# EAGLE design workingflasher (EAGLE 7.1.0)
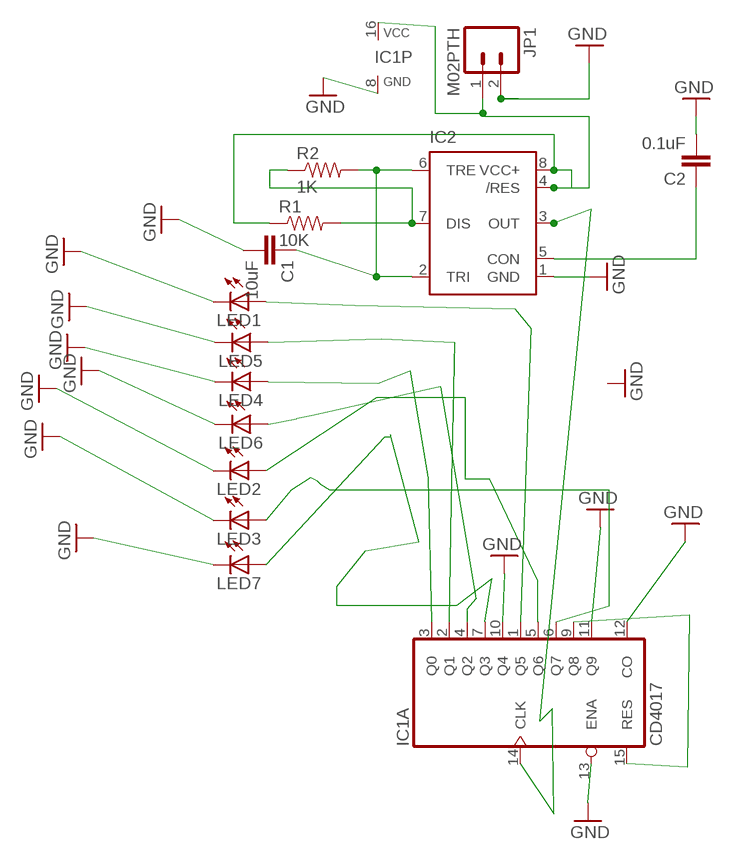
[diagram p0: schematic, sheet 1]

## Parts
C1  10uF  10UF50V20%(1210)  [1210]
C2  0.1uF  0.1UF-25V(+80/-20%)(0603)  [0603-CAP]
IC1  CD4017  [DIL16]
IC2  NE555D  [SO08]
JP1  M02PTH  [1X02]
LED1  LED1206  [LED-1206]
LED2  LED1206  [LED-1206]
LED3  LED1206  [LED-1206]
LED4  LED1206  [LED-1206]
LED5  LED1206  [LED-1206]
LED6  LED1206  [LED-1206]
LED7  LED1206  [LED-1206]
R1  10K  0OHM1/10W5%(0603)  [0603]
R2  1K  0OHM1/10W5%(0603)  [0603]

## Nets
GND: C1.2 C2.2 IC1.8(P:GND) IC1.10(A:Q4) IC1.11(A:Q9) IC1.12(A:CO) IC1.13(A:ENA) IC2.1(GND) JP1.2 LED1.C LED2.C LED3.C LED4.C LED5.C LED6.C LED7.C
N$1: IC1.1(A:Q5) LED1.A
N$2: IC1.5(A:Q6) LED2.A
N$3: IC1.9(A:Q8) IC1.15(A:RES)
N$4: IC1.7(A:Q3) LED7.A
N$5: IC1.3(A:Q0) LED4.A
N$6: IC1.4(A:Q2) LED6.A
N$7: IC1.2(A:Q1) LED5.A
N$8: C2.1 IC2.5(CON)
N$10: C1.1 IC2.2(TRI) IC2.6(TRE) R2.2
N$11: IC1.16(P:VCC) IC2.4(/RES) IC2.8(VCC+) JP1.1 R1.1
N$12: IC2.7(DIS) R1.2 R2.1
N$14: IC1.14(A:CLK) IC2.3(OUT)
N$15: IC1.6(A:Q7) LED3.A

## Library data of the parts
C1 = SparkFun-Capacitors:10UF50V20%(1210): CAP-09824; PROD_ID: CAP-09824
C2 = SparkFun-Capacitors:0.1UF-25V(+80/-20%)(0603): CAP-00810 Ceramic Standard decoupling cap; PROD_ID: CAP-00810
IC1 = SparkFun-DigitalIC:CD4017
IC2 = SparkFun-AnalogIC:NE555: General purpose bipolar Timer
JP1 = SparkFun-Connectors:M02: Standard 2-pin 0.1" header. Use with - straight break away headers ( PRT-00116) - right angle break away headers (PRT-00553) - swiss pins (PRT-00743) - machine pins (PRT-00117) - female headers (PRT-00115) Molex polarized connector foot print use with: PRT-08233 with associated crimp pins and housings. 2.54_SCREWTERM for use with PRT-10571. 3.5mm Screw Terminal footprints for PRT-08084 5mm Screw Terminal footprints for use with PRT-08433
LED1-LED7 = SparkFun-LED:LED: LEDs Standard schematic elements and footprints for 5mm, 3mm, 1206, and 0603 sized LEDs. 5mm - Spark Fun Electronics SKU : COM-00529 (and others)
R1 R2 = SparkFun-Resistors:0OHM1/10W5%(0603): RES-08609; PROD_ID: RES-08609; VALUE: 0

## Board
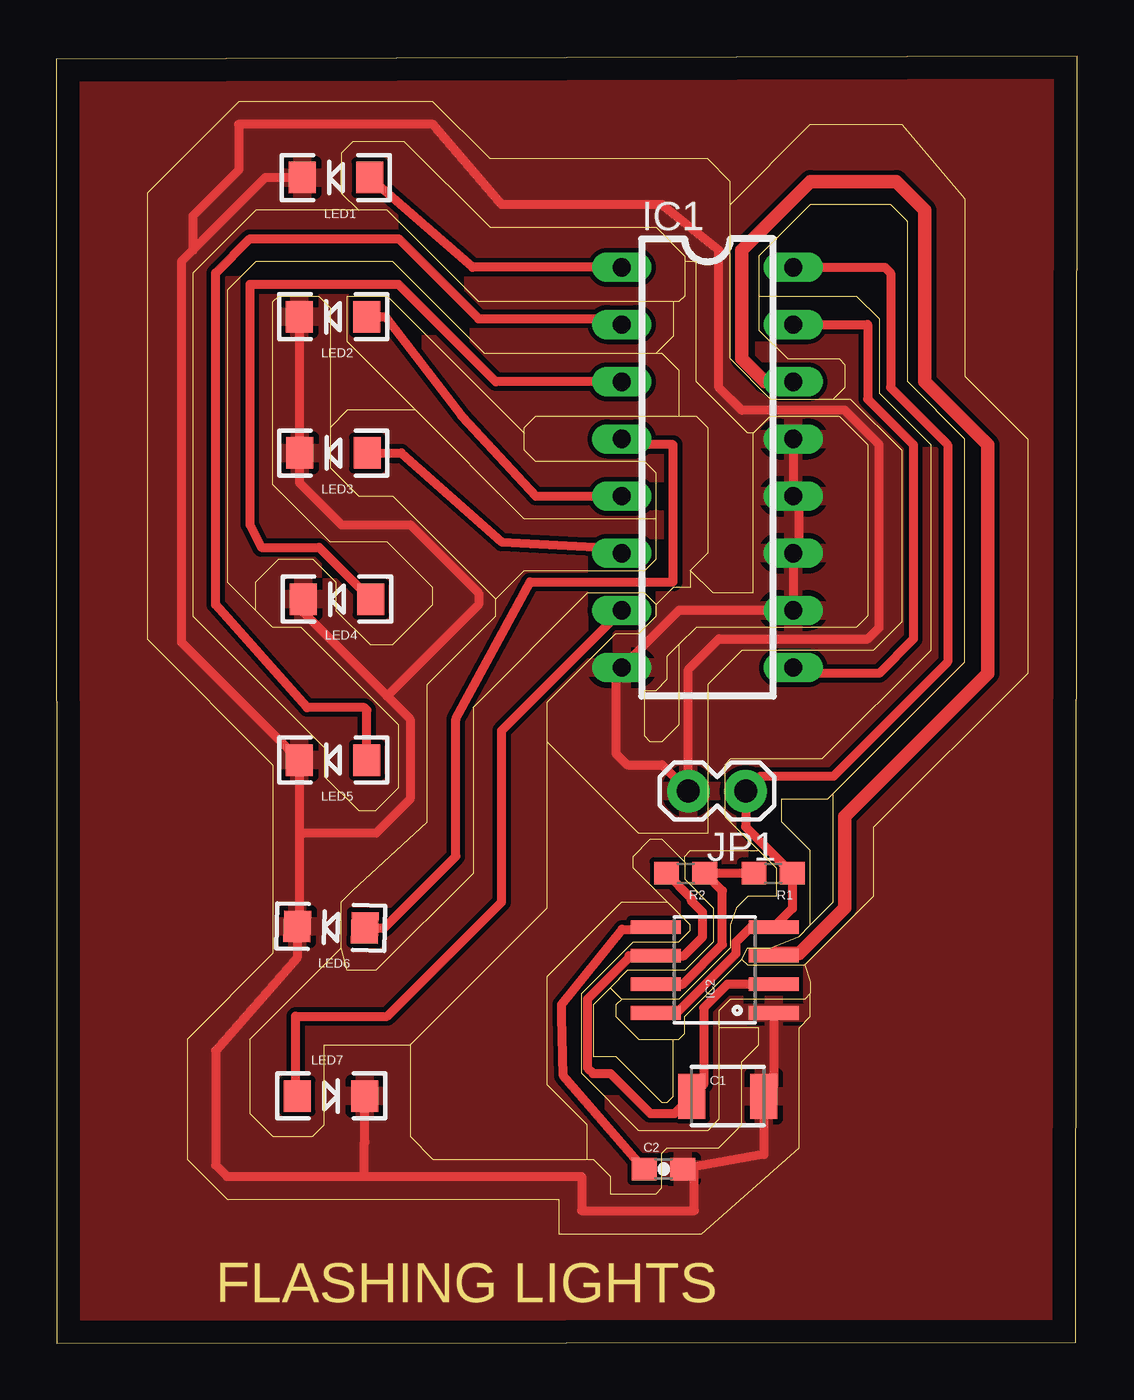
[diagram p1: board, top side]

Size 45.34 x 57.17 mm. Coordinates in mm from the lower left corner, seen from the top.
Outline: 0.01,0 45.27,0.04 45.34,57.17 0,57.05 0.01,0
Copper layers (1*16): Top 0.035mm / dielectric 1.5mm / Bottom 0.035mm
Design rules "default": minimum track width 10mil, minimum drill 24mil, track to track 8mil, track to pad 8mil, pad to pad 8mil, via to via 8mil, smd to smd 8mil, copper to edge 40mil, drill to drill 8mil, minimum pad ring 10mil, minimum via ring 8mil, stop-mask expansion 4mil, vias tented up to drill 0mil, thermal gap 10mil
Milling: 287 lines

### Footprints (pad centres in the part's own frame; a part is rotated, then mirrored left to right if it is on the bottom)
1210 = smd 1.2 x 2: 1 -1.6,0; 2 1.6,0
0603-CAP = smd 1.1 x 1: 1 -0.85,0; 2 0.85,0
DIL16 = drill 0.813 long: 1 -8.89,-3.81; 2 -6.35,-3.81; 3 -3.81,-3.81; 4 -1.27,-3.81; 5 1.27,-3.81; 6 3.81,-3.81; 7 6.35,-3.81; 8 8.89,-3.81; 9 8.89,3.81; 10 6.35,3.81; 11 3.81,3.81; 12 1.27,3.81; 13 -1.27,3.81; 14 -3.81,3.81; 15 -6.35,3.81; 16 -8.89,3.81
SO08 = smd 0.61 x 2.21: 1 -1.905,-2.616; 2 -0.635,-2.616; 3 0.635,-2.616; 4 1.905,-2.616; 5 1.905,2.616; 6 0.635,2.616; 7 -0.635,2.616; 8 -1.905,2.616
1X02 = drill 1.016 pad 1.88: 1 0,0; 2 2.54,0
LED-1206 = smd 1.2 x 1.4: A -1.5,0; C 1.5,0
0603 = smd 1.1 x 1: 1 -0.85,0; 2 0.85,0

### Placement (x,y rotation side)
C1  29.83,10.97 0 top
C2  26.97,7.73 0 top
IC1  28.92,38.91 270 top
IC2  29.24,16.58 90 top
JP1  30.61,24.53 180 top
LED1  12.42,51.78 180 top
LED2  12.3,45.6 180 top
LED3  12.3,39.55 180 top
LED4  12.47,33.06 180 top
LED5  12.29,25.9 180 top
LED6  12.2,18.49 178.7 top
LED7  12.21,10.98 0 top
R1  31.83,20.88 180 top
R2  27.95,20.88 180 top

### Tracks (layer width: path | path; a pad name or v marks a point on that pad's centre or on a via)
GND
  Top 0.406: 28.34,7.83 31.43,8.38 C1.2 31.86,11.4 IC2.1 | 28.34,7.83 C2.2 | 13.68,7.41 13.68,8.93 13.71,8.93 LED7.C | 13.68,7.41 23.33,7.41 23.33,5.89 28.34,5.89 28.34,7.83 | IC1.13 IC1.12 32.98,37.38 32.98,35.35 IC1.11 IC1.10 27.65,32.56 IC1.8 24.86,29.76 24.86,26.21 25.36,25.7 26.9,25.7 JP1.2 28.07,29.93 29.43,31.29 36.03,31.29 36.54,31.79 36.54,39.92 35.02,41.45 30.44,41.45 29.43,42.46 29.43,48.56 26.89,50.59 19.78,50.59 16.73,54.15 8.09,54.15 8.09,52.11 6.06,50.08 6.06,48.56 | 13.68,7.41 7.58,7.41 7.08,7.92 7.08,13 10.7,17.13 LED6.C 10.79,18.61 10.79,22.65 | LED1.C 9.29,51.78 6.06,48.56 | 6.06,48.56 5.55,48.05 5.55,31.14 LED5.C 10.79,22.65 | LED4.C 10.97,32.48 14.7,28.75 | 14.7,28.75 15.71,27.73 15.71,24.17 14.19,22.65 10.79,22.65 | LED3.C 10.8,39.56 LED2.C 10.8,38.23 12.66,36.37 15.71,36.37 18.76,33.32 18.76,32.81 14.7,28.75
  pour Top: -0.81,57.56 46.2,58.22 46.13,-1.17 -0.63,-0.83
N$1
  Top 0.406: IC1.1 18.49,47.8 LED1.A
N$2
  Top 0.406: LED2.A 14.61,45.6 18,41.19 21.3,37.64 IC1.5
N$3
  Top 0.406: IC1.15 36.03,45.26 36.03,41.95 38.06,39.92 38.06,31.29 36.54,29.76 32.98,29.76 IC1.9
N$4
  Top 0.406: LED7.A 10.63,10.98 10.63,14.52 14.7,14.52 19.78,19.6 19.78,27.22 IC1.7
N$5
  Top 0.406: IC1.3 19.52,42.72 15.2,47.03 8.6,47.03 8.6,36.37 9.11,35.35 11.68,35.35 LED4.A
N$6
  Top 0.406: LED6.A 14.56,18.45 17.74,21.63 17.74,27.73 21.05,33.83 27.4,33.83 27.4,39.92 25.36,39.92 IC1.4
N$7
  Top 0.406: LED5.A 13.79,28.13 13.68,28.24 11.14,28.24 7.08,32.81 7.08,47.54 8.6,49.07 15.2,49.07 18.76,45.51 24.86,45.51 IC1.2
N$8
  Top 0.406: C2.1 22.52,11.88 22.44,14.53 22.44,15.05 25.13,18.39 26.53,18.39 IC2.5
N$10
  Top 0.406: IC2.2 29.81,15.95 28.75,14.89 28.75,11.49 C1.1 | 28.18,11.01 C1.1 | R2.2 28.21,19.77 28.21,19.64 28.71,19.14 28.71,18.05 27.87,17.22 IC2.6 25.44,17.22 25.44,17.14 23.59,15.28 23.59,12.24 23.84,11.98 24.6,11.98 26.38,10.2 27.46,10.2 C1.1
N$11
  Top 0.406: IC2.4 31.38,18.49 | IC2.8 26.65,14.65 27.55,14.65 27.55,14.67 30.19,17.32 30.19,17.82 30.95,18.59 31.76,18.59 IC2.4 | IC1.16 36.79,47.8 37.05,47.54 37.05,42.46 39.59,39.92 39.59,30.27 34.51,25.19 31.27,25.19 JP1.1 30.61,22.95 R1.1 32.68,19.31 IC2.4
N$12
  Top 0.406: R1.2 R2.1 29.58,20.1 29.58,17.71 27.81,15.95 IC2.7
N$14
  Top 0.61: IC1.14 31.46,42.72 30.44,43.73 30.44,48.56 33.49,51.61 37.3,51.61 38.57,50.34 38.57,42.72 41.37,39.92 41.37,29.76 35.02,23.41 35.02,19.35 32.98,17.32 31.96,17.32 IC2.3
N$15
  Top 0.406: LED3.A 15.32,39.55 19.78,35.6 24.35,35.35 IC1.6

### Text on the board
Milling: FLASHING LIGHTS